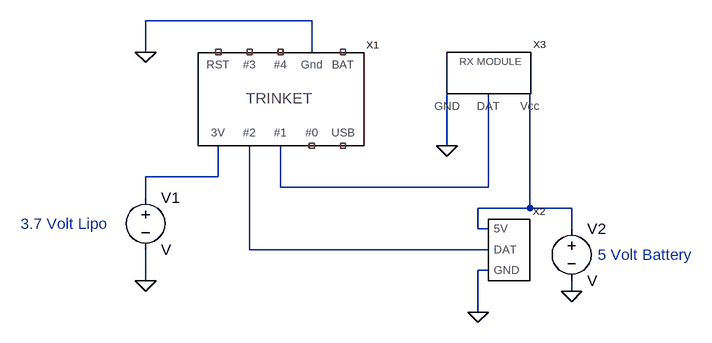
[diagram p0: schematic Head Circuit.asc]
Head Circuit.asc, the LTspice schematic file:
Version 4.1
SHEET 1 988 680
WIRE 384 0 128 0
WIRE 128 48 128 0
WIRE 384 48 384 0
WIRE 592 192 592 112
WIRE 240 240 240 192
WIRE 240 240 128 240
WIRE 336 256 336 192
WIRE 656 256 656 112
WIRE 656 256 336 256
WIRE 128 272 128 240
WIRE 720 288 720 112
WIRE 720 288 640 288
WIRE 784 288 720 288
WIRE 640 320 640 288
WIRE 656 320 640 320
WIRE 784 320 784 288
WIRE 288 352 288 192
WIRE 656 352 288 352
WIRE 656 384 640 384
WIRE 128 400 128 352
WIRE 784 416 784 400
WIRE 640 448 640 384
FLAG 640 448 0
FLAG 784 416 0
FLAG 128 400 0
FLAG 592 192 0
FLAG 128 48 0
SYMBOL voltage 128 256 R0
SYMATTR InstName V1
SYMBOL Trinket 224 48 R0
SYMATTR InstName X1
SYMBOL WS2812B\ RGB\ LED 608 368 R0
SYMATTR InstName X2
SYMBOL voltage 784 304 R0
SYMATTR InstName V2
SYMBOL RF\ Transmitter 592 112 R0
SYMATTR InstName X3
TEXT -64 312 Left 2 ;3.7 Volt Lipo
TEXT 824 360 Left 2 ;5 Volt Battery

The netlist it stands for:
* Head Circuit.asc
V1 N001 0 V
X§X1 N001 N004 N002 NC_01 NC_02 NC_03 NC_04 NC_05 0 NC_06 Trinket  ; pins 3V #2 #1 #0 USB RST #3 #4 Gnd BAT
X§X2 N004 0 N003 WS2812B RGB LED  ; pins DAT GND 5V
V2 N003 0 V
X§X3 0 N002 N003 RF Transmitter  ; pins GND DAT Vcc
* 3.7 Volt Lipo
* 5 Volt Battery
.backanno
.end